# Altium schematic sheet Conn_Unit.SchDoc
size A3
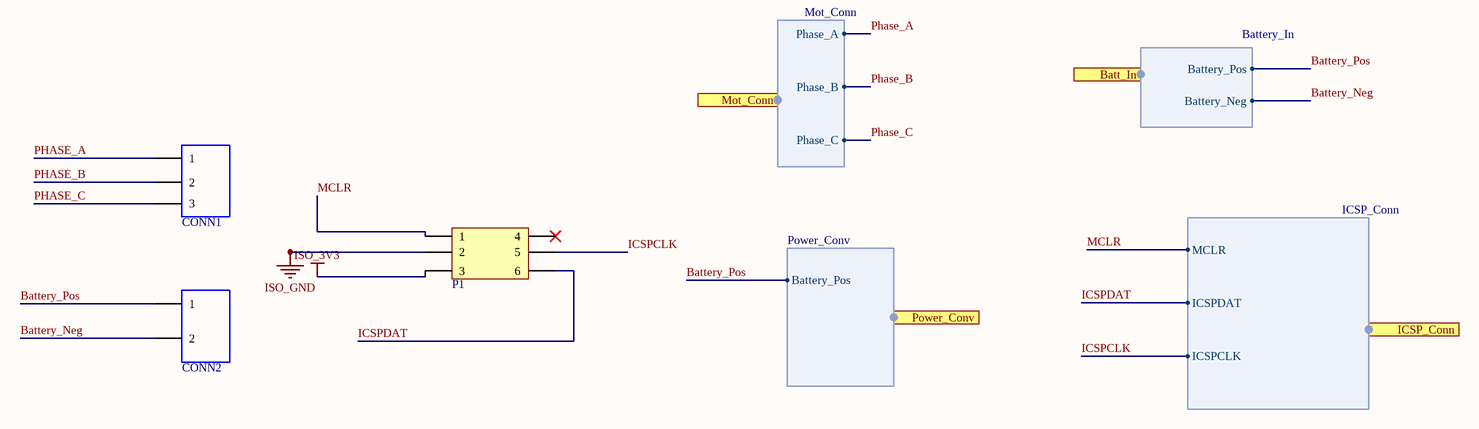
[diagram p0: Conn_Unit.SchDoc]

## Parts
CONN1  CONN KLE3  [kle3]  (value not drawn)
CONN2  CONN KLE2  [kle2]  (value not drawn)
P1  H3X2  [H3X2]  (value not drawn)

## Ports
Batt_In (harness Battery_In), ICSP_Conn (harness ICSP_Conn), Mot_Conn (harness Mot_Conn), Power_Conv (harness Power_Conv)

## Harnesses
Mot_Conn: Phase_A, Phase_B, Phase_C
Battery_In: Battery_Pos, Battery_Neg
Power_Conv: Battery_Pos
ICSP_Conn: MCLR, ICSPDAT, ICSPCLK

## Nets
ISO_3V3: P1.3
ISO_GND: P1.2
Battery_Neg: CONN2.2 ; port Batt_In.Battery_Neg
Battery_Pos: CONN2.1 ; port Batt_In.Battery_Pos, port Power_Conv.Battery_Pos
ICSPCLK: P1.5 ; port ICSP_Conn.ICSPCLK
ICSPDAT: P1.6 ; port ICSP_Conn.ICSPDAT
MCLR: P1.1 ; port ICSP_Conn.MCLR
PHASE_A: CONN1.1 ; port Mot_Conn.Phase_A
PHASE_B: CONN1.2 ; port Mot_Conn.Phase_B
PHASE_C: CONN1.3 ; port Mot_Conn.Phase_C

Not connected (* = marked no-connect by the designer): P1 4*

## Notes on the sheet
- Title
- Size:
- Date:
- A3
- Number:
- Time:
- Revision:
- Sheet
- of
- File: